# EAGLE design wahmodgnd (EAGLE 8.3.2)
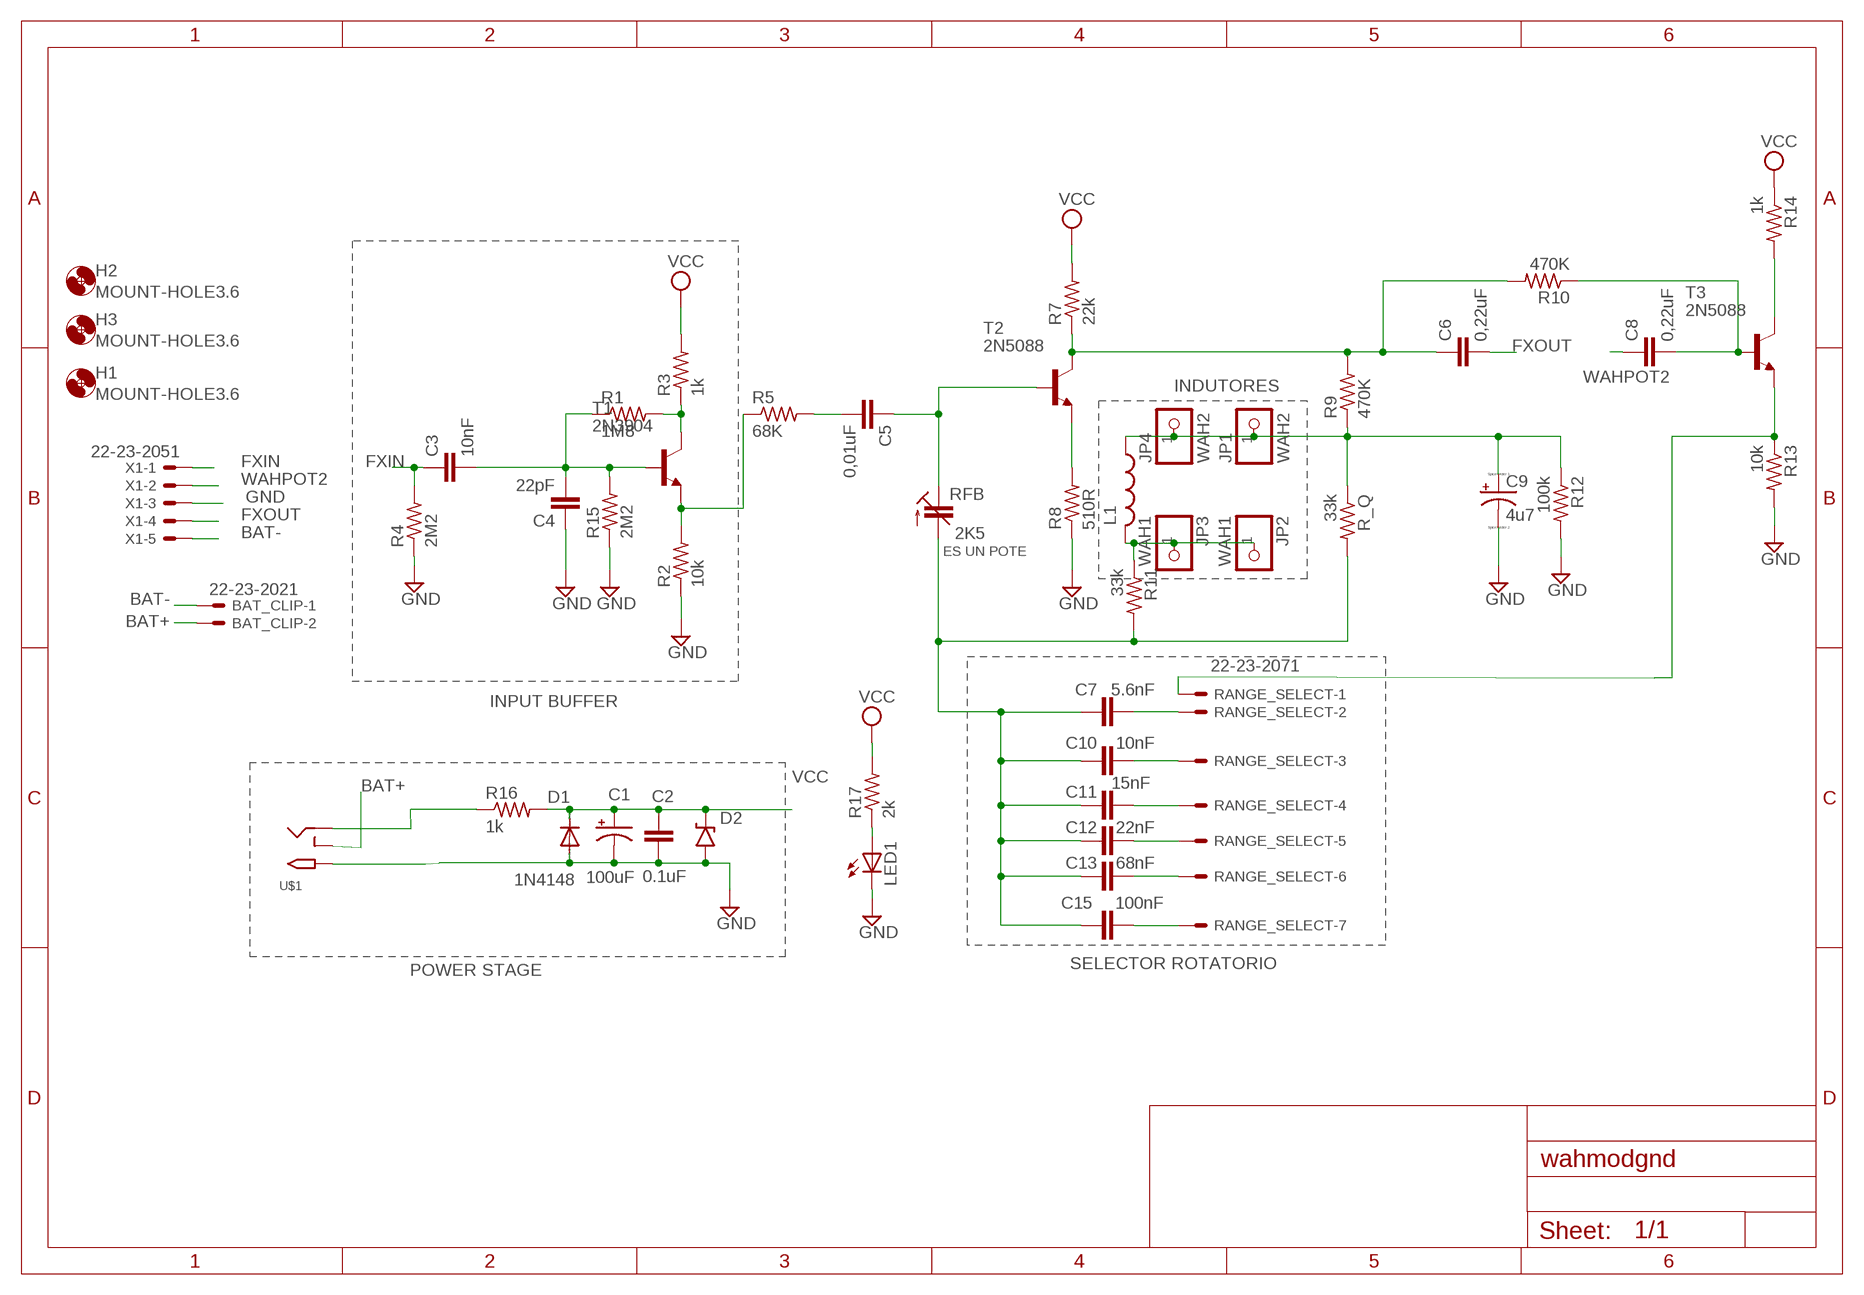
[diagram p0: schematic, sheet 1]

## Parts
BAT_CLIP  22-23-2021  [22-23-2021]
C1  100uF  CPOL-USE2.5-5  [E2,5-5]
C2  0.1uF  C-EU025-025X050  [C025-025X050]
C3  10nF  C-EU050-025X075  [C050-025X075]
C4  22pF  C-EU050-025X075  [C050-025X075]
C5  0,01uF  C-EU050-035X075  [C050-035X075]
C6  0,22uF  C-EU050-035X075  [C050-035X075]
C7  5.6nF  C-EU050-030X075  [C050-030X075]
C8  0,22uF  C-EU050-035X075  [C050-035X075]
C9  4u7  CPOL-USE2.5-6  [E2,5-6]
C10  10nF  C-EU050-030X075  [C050-030X075]
C11  15nF  C-EU050-030X075  [C050-030X075]
C12  22nF  C-EU050-030X075  [C050-030X075]
C13  68nF  C-EU050-030X075  [C050-030X075]
C15  100nF  C-EU050-030X075  [C050-030X075]
D1  1N4148  1N4148DO35-7  [DO35-7]
D2  1N9ZENER  [DO35-3]
H1  MOUNT-HOLE3.6  [3,6]
H2  MOUNT-HOLE3.6  [3,6]
H3  MOUNT-HOLE3.6  [3,6]
JP1  WAH2  PINHD-1X1  [1X01]
JP2  WAH1  PINHD-1X1  [1X01]
JP3  WAH1  PINHD-1X1  [1X01]
JP4  WAH2  PINHD-1X1  [1X01]
L1  WAH  [WAH]
LED1  TLLY4400  [LED3MM]
R1  1M8  R-US_0204/7  [0204/7]
R2  10k  R-US_0204/7  [0204/7]
R3  1k  R-US_0204/7  [0204/7]
R4  2M2  R-US_0204/7  [0204/7]
R5  68K  R-US_0204/7  [0204/7]
R7  22k  R-US_0204/7  [0204/7]
R8  510R  R-US_0204/7  [0204/7]
R9  470K  R-US_0204/7  [0204/7]
R10  470K  R-US_0204/7  [0204/7]
R11  33k  R-US_0204/7  [0204/7]
R12  100k  R-US_0204/7  [0204/7]
R13  10k  R-US_0204/7  [0204/7]
R14  1k  R-US_0204/7  [0204/7]
R15  2M2  R-US_0204/7  [0204/7]
R16  1k  R-US_0204/7  [0204/7]
R17  2k  R-US_0204/7  [0204/7]
R_Q  33k  R-US_0204/7  [0204/7]
RANGE_SELECT  22-23-2071  [22-23-2071]
RFB  2K5  C-TRIMM808-7.5  [CTRIM808-BC7.5]
T1  2N3904  [TO92]
T2  2N5088  [TO92]
T3  2N5088  [TO92]
U$1  2.1MMJACKTHM  [PJ-102A]
X1  22-23-2051  [22-23-2051]

## Nets
BAT+: BAT_CLIP.2 U$1.RING_SW
BAT-: BAT_CLIP.1 X1.5
FXIN: C3.1 R4.2 X1.1
FXOUT: C6.2 X1.4
GND: C1.- C2.2 C4.1 C9.- D1.A D2.A LED1.K(C) R2.1 R4.1 R8.1 R12.2 R13.2 R15.1 U$1.TIP X1.3
N$1: C3.2 C4.2 R1.1 R15.2 T1.2(B)
N$2: R2.2 R5.1 T1.3(E)
N$3: R16.1 U$1.RING
N$4: JP2.1 JP3.1 L1.2 R11.1
N$5: R1.2 R3.1 T1.1(C)
N$6: R13.1 RANGE_SELECT.1 T3.3(E)
N$7: C5.2 R5.2
N$8: C5.1 RFB.1(E) T2.2(B)
N$9: C6.1 R7.1 R9.2 R10.2 T2.1(C)
N$10: C7.2 RANGE_SELECT.2
N$11: C10.2 RANGE_SELECT.3
N$12: C9.+ JP1.1 JP4.1 L1.1 R9.1 R12.1 R_Q.1
N$13: C11.2 RANGE_SELECT.4
N$14: C12.2 RANGE_SELECT.5
N$15: C7.1 C10.1 C11.1 C12.1 C13.1 C15.1 R11.2 R_Q.2 RFB.2(A)
N$16: C13.2 RANGE_SELECT.6
N$17: R8.2 T2.3(E)
N$18: R14.2 T3.1(C)
N$19: C15.2 RANGE_SELECT.7
N$20: LED1.A R17.1
N$22: C8.2 R10.1 T3.2(B)
VCC: C1.+ C2.1 D1.C D2.C R3.2 R7.2 R14.1 R16.2 R17.2
WAHPOT2: C8.1 X1.2

## Notes on the sheet
- INDUTORES
- ES UN POTE
- INPUT BUFFER
- SELECTOR ROTATORIO
- POWER STAGE

## Library data of the parts
BAT_CLIP = con-molex:22-23-2021: .100" (2.54mm) Center Header - 2 Pin; MF: MOLEX; MPN: 22-23-2021; OC_FARNELL: 1462926; OC_NEWARK: 25C3832
C1 = rcl:CPOL-US: POLARIZED CAPACITOR, American symbol
C2 = rcl:C-EU: CAPACITOR, European symbol
C3-C8 C10-C13 C15 = resistor:C-EU: CAPACITOR, European symbol
C9 = resistor:CPOL-US: POLARIZED CAPACITOR, American symbol
D1 = diode:1N4148: DIODE high speed (Philips)
D2 = gm-diodes:1N9*ZENER: 1N9???B Zener Diode DO-35 case 1N957B - 1N992B (6.8V to 200V)
H1-H3 = holes:MOUNT-HOLE: MOUNTING HOLE with drill center marker
JP1-JP4 = pinhead:PINHD-1X1: PIN HEADER
L1 = gm-inductors:WAH: Wah Inductor pads placed on 0.4" x 0.4" spacing some packages use 0.3" x 0.3" spacing use template to fill in additional pads and traces as required
LED1 = led:TLLY4400: Low Current (2mA) LED 3 mm Tinted Diffused Package color YELLOW Source: Data sheet <http://www.farnell.com/datasheets/391098.pdf>; MF: VISHAY SEMICONDUCTOR; OC_FARNELL: 1612439
R1-R5 R7-R17 R_Q = resistor:R-US_: RESISTOR, American symbol
RANGE_SELECT = con-molex:22-23-2071: .100" (2.54mm) Center Header - 7 Pin; MF: MOLEX; MPN: 22-23-2071; OC_FARNELL: 1654534; OC_NEWARK: 56H0445
RFB = rcl:C-TRIMM: Trimm capacitor
T1 = transistor:2N3904: NPN TRANSISTOR
T2 T3 = transistor:2N5088: NPN TRANSISTOR
U$1 = adafruit:2.1MMJACK: 2.1mm x 5.5mm THM DC jack with internal switch. Digikey part #PJ-102A, 4UCON part #05537 2.1mm x 5.5mm SMT DC jack with internal switch. Digikey part #PJ-002A-SMT, 4UCON part #03267 By microbuilder.eu & adafruit.com
X1 = con-molex:22-23-2051: .100" (2.54mm) Center Header - 5 Pin; MF: MOLEX; MPN: 22-23-2051; OC_FARNELL: 1462952; OC_NEWARK: 38C9178

## Board
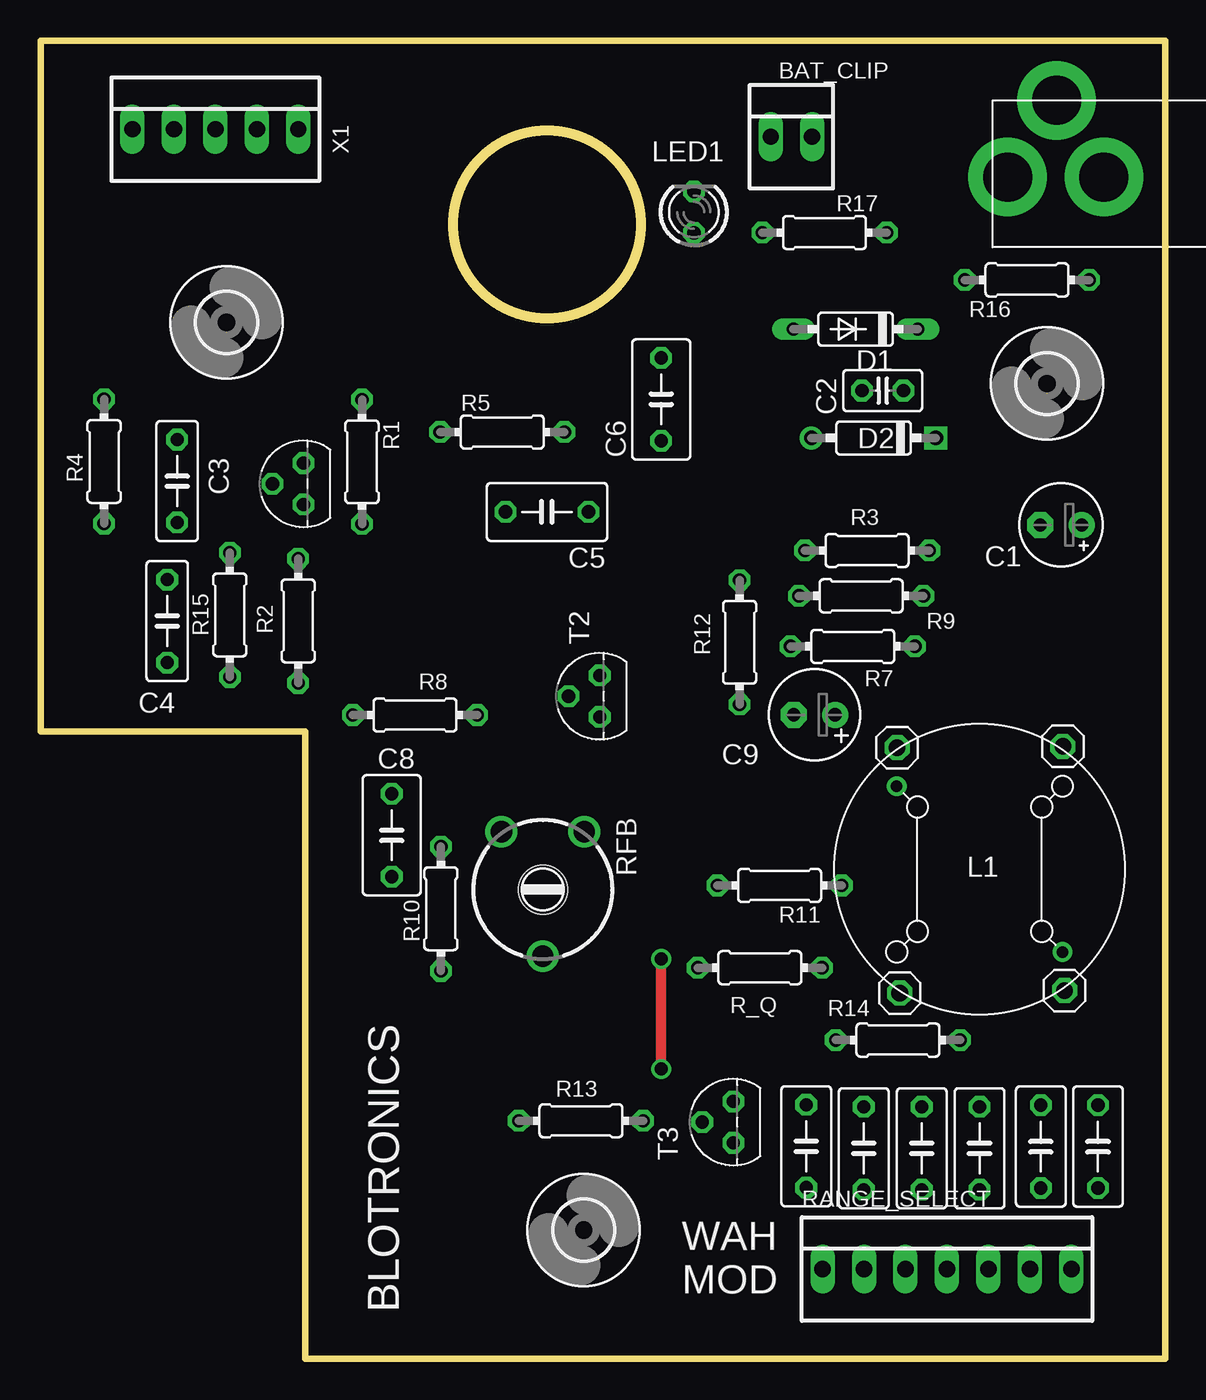
[diagram p1: board, top side]
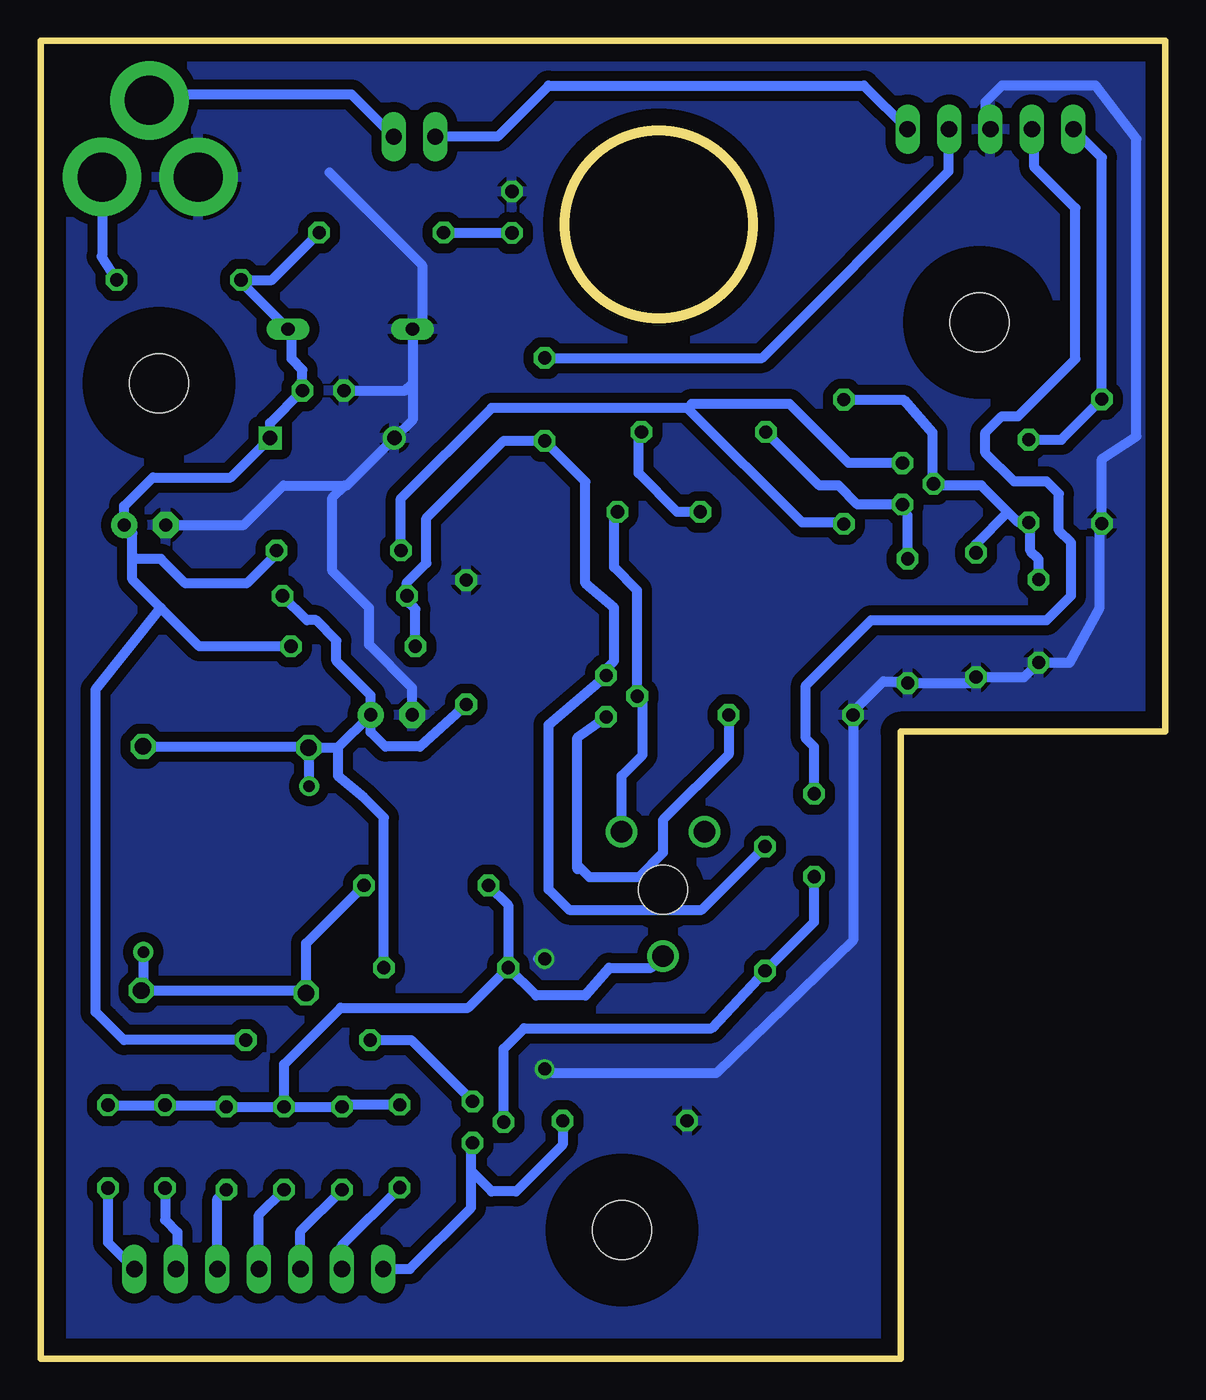
[diagram p2: board, bottom side, seen from below]

Size 68.86 x 80.75 mm. Coordinates in mm from the lower left corner, seen from the top.
Outline: 0,38.42 16.19,38.42 16.19,0 68.86,0 68.86,80.75 0,80.75 0,38.42
Outline: circle at 31,69.5 radius 5.76
Copper layers (1*16): Top 0.035mm / dielectric 1.5mm / Bottom 0.035mm
Design rules "default": minimum track width 10mil, minimum drill 24mil, track to track 8mil, track to pad 8mil, pad to pad 8mil, via to via 8mil, smd to smd 8mil, copper to edge 40mil, drill to drill 8mil, minimum pad ring 10mil, minimum via ring 8mil, stop-mask expansion 4mil, vias tented up to drill 0mil, thermal gap 10mil

### Footprints (pad centres in the part's own frame; a part is rotated, then mirrored left to right if it is on the bottom)
22-23-2021 = drill 1 long: 1 -1.27,0; 2 1.27,0
E2,5-5 = drill 0.813 pad 1.6: + -1.27,0 | drill 0.813 pad 1.6 octagon: - 1.27,0
C025-025X050 = drill 0.813 octagon: 1 -1.27,0; 2 1.27,0
C050-025X075 = drill 0.813 octagon: 1 -2.54,0; 2 2.54,0
C050-035X075 = drill 0.813 octagon: 1 -2.54,0; 2 2.54,0
C050-030X075 = drill 0.813 octagon: 1 -2.54,0; 2 2.54,0
E2,5-6 = drill 0.813 pad 1.6: + -1.27,0 | drill 0.813 pad 1.6 octagon: - 1.27,0
DO35-7 = drill 0.813 long: A 3.81,0; C -3.81,0
DO35-3 = drill 0.9: A 3.81,0 | drill 0.9 square: C -3.81,0
3,6 = hole 3.6: 0,0
1X01 = drill 1.016 octagon: 1 0,0
WAH = drill 0.7: 1 -5.08,5.08; 2 5.08,-5.08
LED3MM = drill 0.813 octagon: A -1.27,0; K 1.27,0
0204/7 = drill 0.813 octagon: 1 -3.81,0; 2 3.81,0
22-23-2071 = drill 1 long: 1 -7.62,0; 2 -5.08,0; 3 -2.54,0; 4 0,0; 5 2.54,0; 6 5.08,0; 7 7.62,0
CTRIM808-BC7.5 = drill 1.3: 1 -2.54,-2.54; 2 0,5.08; 3 2.54,-2.54 | hole 3: 0,1
TO92 = drill 0.813 octagon: 1 1.27,0; 2 0,1.905; 3 -1.27,0
PJ-102A = drill 3 pad 4.8: RING 0.1,-3.39; RING_SW -4.6,-6.29; TIP 0.1,-9.29
22-23-2051 = drill 1 long: 1 -5.08,0; 2 -2.54,0; 3 0,0; 4 2.54,0; 5 5.08,0

### Placement (x,y rotation side)
BAT_CLIP  45.97,74.87 0 top
C1  62.48,51.08 180 top
C2  51.56,59.31 180 top
C3  8.35,53.77 270 top
C4  7.74,45.19 90 top
C5  31,51.88 180 top
C6  38,58.78 90 top
C7  46.88,13.02 270 top
C8  21.49,32.08 270 top
C9  47.38,39.45 180 top
C10  50.41,12.89 270 top
C11  53.95,12.89 270 top
C12  57.5,12.89 270 top
C13  61.25,13 270 top
C15  64.75,13 270 top
D1  49.9,63.08 180 top
D2  51.01,56.41 180 top
H1  33.25,7.87 0 top
H2  11.38,63.5 0 top
H3  61.62,59.75 0 top
JP1  52.45,37.44 0 top
JP2  52.61,22.4 0 top
JP3  62.7,22.56 0 top
JP4  62.59,37.52 0 top
L1  57.5,30 0 top
LED1  40,70.25 90 top
R1  19.67,54.95 270 top
R2  15.76,45.2 90 top
R3  50.61,49.52 0 top
R4  3.87,54.98 90 top
R5  28.26,56.78 0 top
R7  49.73,43.64 0 top
R8  22.92,39.44 0 top
R9  50.24,46.74 180 top
R10  24.5,27.57 90 top
R11  45.25,29 180 top
R12  42.8,43.89 90 top
R13  33.08,14.58 180 top
R14  52.49,19.52 180 top
R15  11.57,45.57 90 top
R16  60.4,66.1 180 top
R17  48,69 0 top
R_Q  44.04,23.96 180 top
RANGE_SELECT  55.5,5.5 0 top
RFB  30.75,29.75 180 top
T1  16.09,53.61 90 top
T2  34.23,40.59 90 top
T3  42.41,14.5 90 top
U$1  68.5,72.5 270 top
X1  10.69,75.33 0 top

### Tracks (layer width: path | path; a pad name or v marks a point on that pad's centre or on a via)
BAT+
  Bottom 0.61: BAT_CLIP.2 49.84,77.47 61.84,77.47 U$1.RING_SW
BAT-
  Bottom 0.61: X1.5 18.44,78 37.75,78 40.88,74.87 BAT_CLIP.1
FXIN
  Bottom 0.61: X1.1 3.87,73.59 R4.2 6.35,56.31 C3.1
FXOUT
  Bottom 0.61: C6.2 24.68,61.31 13.25,72.75 13.25,75.31 X1.4
GND  (via drill 0.8)
  Top 0.61: v38,17.75 v38,24.5
  Bottom 0.61: 51.17,72.67 45.5,67 45.5,63.67 D1.A 46.09,59.75 | 46.09,59.75 46.09,57.52 D2.A 50.11,53.5 50.25,53.5 | C2.2 46.52,59.31 46.09,59.75 | X1.3 11,75.64 11,77 10,78 4.25,78 1.75,74.75 1.75,56.5 3.87,55.12 R4.1 4,50.79 4,46 5.84,42.65 C4.1 8.63,41.76 R15.1 11.94,41.4 R2.1 15.87,41.5 17.25,41.5 19.11,39.64 R8.1 19.11,25.64 27.5,17.5 37.5,17.5 v38,17.75 | v38,24.5 38.41,24.5 | C1.- 56.42,51.08 54,53.5 50.25,53.5 | C9.- 46.11,41.11 48.75,43.75 48.75,46 51,48.25 51,52.75 50.25,53.5
  pour Bottom (isolate 0.61): 0.5,79.5 0.5,39 16.75,39 16.75,0.5 67,0.5 67,79.25
N$1
  Bottom 0.61: R1.1 16.02,58.76 14.25,56.75 14.25,54.04 T1.2 14.07,53.5 11.25,53.5 9.62,51.87 | C4.2 7.74,48.99 8.25,49.5 8.25,51.13 C3.2 8.98,51.23 9.62,51.87 | R15.2 11.57,49.92 9.62,51.87
N$2
  Bottom 0.61: R2.2 15.76,51.66 T1.3 18.84,52.34 20,53.5 21.18,53.5 R5.1
N$3
  Bottom 0.61: R16.1 65.15,67.54 65.11,67.58 U$1.RING
N$4
  Bottom 0.61: L1.2 62.58,22.69 JP3.1 52.77,22.56 JP2.1 52.61,25.45 R11.1
N$5
  Bottom 0.61: R3.1 46.8,52.7 41.25,58.25 29.25,58.25 | 29.25,58.25 22.25,51.25 19.78,51.25 R1.2 | T1.1 19.38,54.87 23,58.5 29,58.5 29.25,58.25
N$6
  Bottom 0.61: 42.44,13.25 T3.3 42.5,13.14 42.5,11.5 | RANGE_SELECT.1 46.25,5.5 42.5,9.25 42.5,11.5 | R13.1 36.89,13.11 39.75,10.25 41.25,10.25 42.5,11.5
N$7
  Bottom 0.61: C5.2 29.89,51.88 32.25,54.25 32.25,56.6 R5.2
N$8
  Bottom 0.61: C5.1 33.75,51.68 33.75,48.5 32.33,47.08 T2.2 32,40.26 32,37 33.29,35.71 RFB.1
N$9
  Bottom 0.61: 37.98,56.25 C6.1 | C6.1 40.5,56.25 45.25,51.5 45.25,48.75 46.44,47.56 R9.2 46.44,46.43 46,46 45.92,45.92 R7.1 | R10.2 28.39,27.5 36.5,27.5 37.75,28.75 37.75,38.84 T2.1 34.23,42.26 33.75,42.75 33.75,46 35.5,47.5 35.5,53.74 C6.1
N$10
  Bottom 0.61: RANGE_SELECT.2 50.42,6.94 C7.2
N$11
  Bottom 0.61: RANGE_SELECT.3 52.96,7.8 C10.2
N$12
  Bottom 0.61: C9.+ 48.65,40.65 50.75,42.75 50.75,44 52,45.25 52.56,45.25 R9.1 | JP1.1 50.66,37.44 | 50.66,37.44 C9.+ | 52.75,37.14 JP1.1 | JP4.1 52.52,37.51 JP1.1 | 50.66,37.44 50.66,35.71 49.04,34.34 47.85,33.15 R_Q.1 | R12.1 45.64,37.5 47.75,37.5 48.65,38.4 C9.+ | L1.1 52.42,37.41 JP1.1
N$13
  Bottom 0.61: RANGE_SELECT.4 55.5,8.81 C11.2
N$14
  Bottom 0.61: RANGE_SELECT.5 58.04,9.81 C12.2
N$15
  Bottom 0.61: C15.1 C13.1 57.6,15.54 C12.1 C11.1 | C11.1 C10.1 50.28,15.56 C7.1 | C11.1 53.95,18.04 50.5,21.5 42.69,21.5 R_Q.2 | R_Q.2 38.52,22.25 35.5,22.25 34.05,23.95 31.47,23.95 RFB.2 | R11.2 40.23,27.79 R_Q.2
N$16
  Bottom 0.61: C13.2 61.25,8.5 60.5,7.75 60.5,5.58 RANGE_SELECT.6
N$17
  Bottom 0.61: 36,30 36,30.25 | 36,30.25 36,38.05 T2.3 | R8.2 26.73,37.02 30.75,33 30.75,31 32.25,29.5 35.25,29.5 36,30.25
N$18
  Bottom 0.61: R14.2 46.17,19.52 T3.1
N$19
  Bottom 0.61: C15.2 64.75,7.13 RANGE_SELECT.7
N$20
  Bottom 0.61: R17.1 40.02,69 LED1.A
N$22
  Bottom 0.61: T3.2 40.51,18.99 39.25,20.25 27.77,20.25 R10.1 24.49,23.76 21.5,26.75 C8.2
VCC
  Bottom 0.61: R7.2 59.15,43.65 61.5,46 | 61.5,46 63.25,47.75 63.25,49.25 | 63.25,49.25 63.25,50.58 C1.+ 63.75,52.25 62,54 57.23,54 D2.C 54.82,57.33 C2.1 52.83,60.58 53.5,61.25 53.5,62.87 D1.C 56.59,65.96 R16.2 54.71,66.1 R17.2 | R14.1 63.77,19.52 65.5,21.25 65.5,41 61.5,46 | R3.2 54.42,49.33 56.25,47.5 60,47.5 61.5,49 63,49 63.25,49.25
WAHPOT2
  Bottom 0.61: X1.2 8,75.18 8,73 5.5,70.5 5.5,61.25 9,57.75 10,57.75 11,56.75 11,55.5 9.25,53.75 7.25,53.75 6.5,53 6.5,50.75 5.75,50 5.75,46.75 7.25,45.25 18,45.25 22,41.25 22,38 21.49,37.49 C8.1

### Text on the board
tPlace: BLOTRONICS | WAH / MOD